# Altium schematic sheet Сharger for auto.SchDoc: Sonar Radio transmitter №1
size A4; ApprovedBy: Логвиненко; CheckedBy: Левинец; Author: Спеян; CompanyName: Garage; DrawnBy: 16; Engineer: ,; Organization: 23; Address1: Protect During; Address2: a Zombie; Address3: Apocalypse; Address4: №1. braaains.....; DocumentNumber: Garage; Revision: 1; SheetNumber: 1; SheetTotal: 1; Scale: 1:1; Name Value: Сонар; ProcessInspection: Сharger for auto.SchDoc; NormInspection: ,; Letter1Column: S; Letter2Column: -; Letter3Column: -; DocumentType: Схема електрическая принципиальная; Mass: .; FirstReferrence: SDE 525.1 111 017 ME; Grupa: gr. E-111; Time: Garage; Rule: 26; ImagePath: 18; Application_BuildNumber: 5
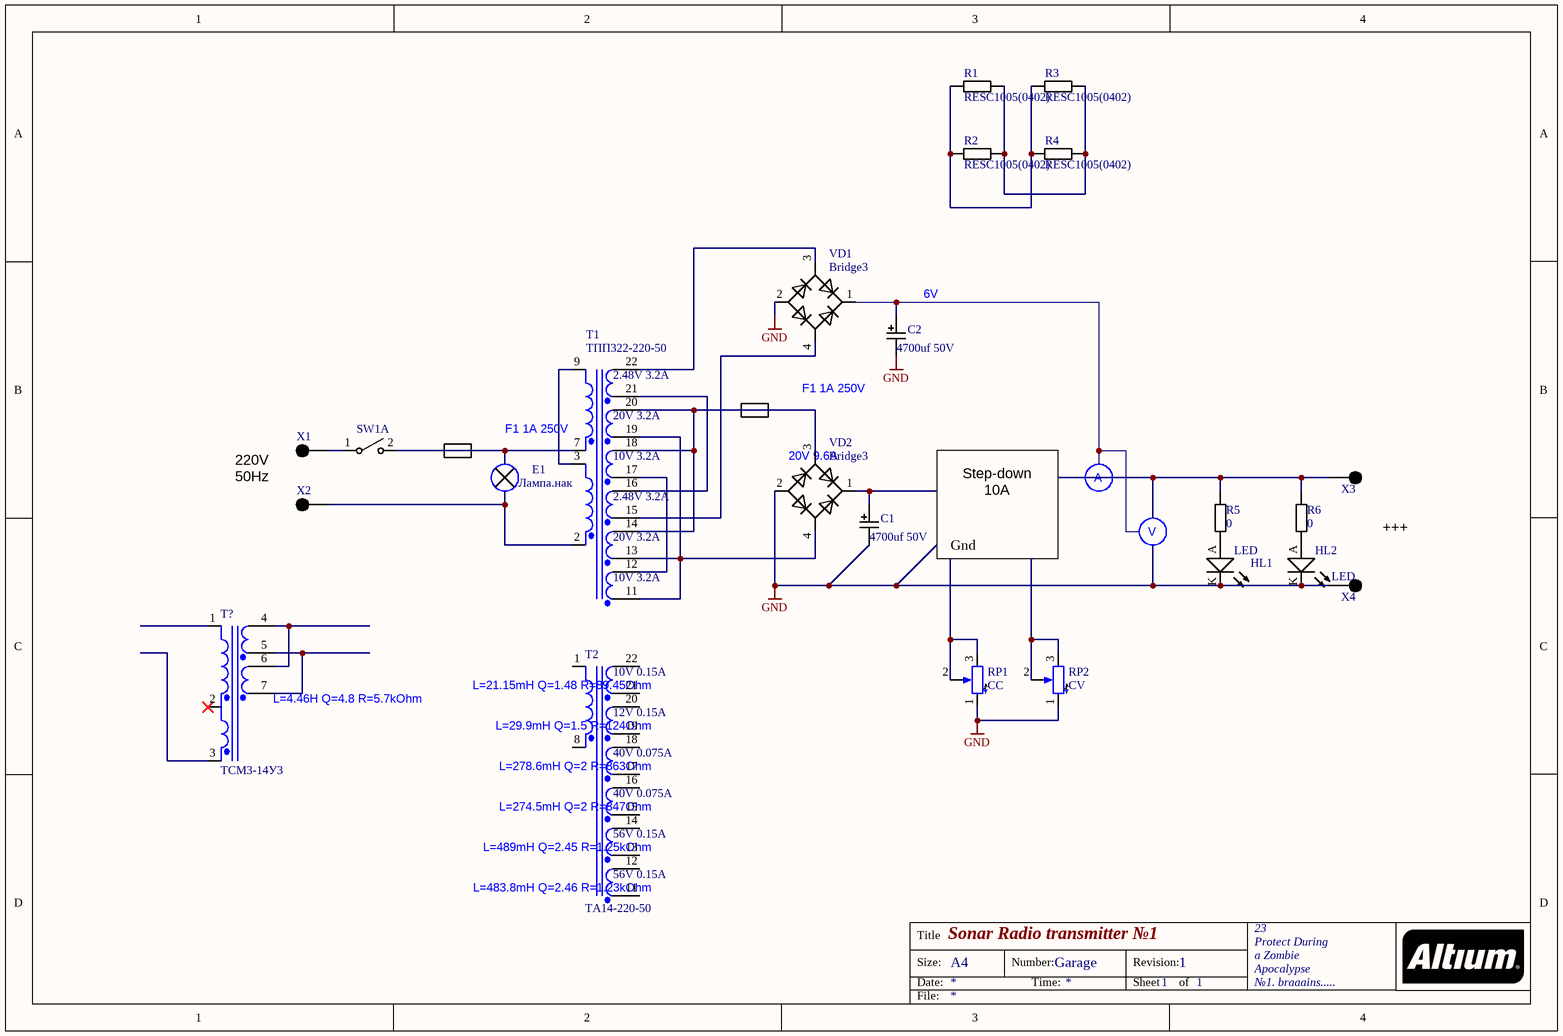
[diagram p0: Сharger for auto.SchDoc]

## Parts
C1  4700uf 50V  [CAPMP3528X210N]
C2  4700uf 50V  [CAPMP3528X210N]
E1  Лампа.нак
HL1  LED  [LED 5mm Green]
HL2  LED  [LED 5mm Green]
R1  RESC1005(0402)  [REZKemet 0402]
R2  RESC1005(0402)  [REZKemet 0402]
R3  RESC1005(0402)  [REZKemet 0402]
R4  RESC1005(0402)  [REZKemet 0402]
R5  0  [REZKemet 0402]
R6  0  [REZKemet 0402]
RP1  CC  [POT16K1-LIN]
RP2  CV  [POT16K1-LIN]
SW1  219-12MST  [219-12MST]  (value not drawn)  (part A of 12)
T1  ТПП322-220-50
T2  ТА14-220-50
T?  ТСМ3-14У3
VD1  Bridge3  [DF206ST-G]
VD2  Bridge3  [DF206ST-G]
X1  X1-PLS-1  [HoleSolderPLS-1]  (value not drawn)
X2  X1-PLS-1  [HoleSolderPLS-1]  (value not drawn)
X3  X1-PLS-1  [HoleSolderPLS-1]  (value not drawn)
X4  X1-PLS-1  [HoleSolderPLS-1]  (value not drawn)

## Nets
GND: C1.2 C2.2 HL1.K HL2.K RP1.1(TOP) RP2.1(TOP) VD1.2(A) VD2.2(A) X4.1
NetC1_1: C1.1 VD2.1(C)
NetC2_1: C2.1 VD1.1(C)
NetHL1_A: HL1.A R5.1
NetHL2_A: HL2.A R6.1
NetR1_1: R1.1 R2.1 R3.1 R4.1
NetR1_2: R1.2 R2.2 R3.2 R4.2
NetR5_2: R5.2 R6.2 X3.1
NetRP1_2: RP1.2(BOT) RP1.3(TAP)
NetRP2_2: RP2.2(BOT) RP2.3(TAP)
NetSW1_1: SW1.1 X1.1
NetSW1_2: SW1.2 T1.7(Pri2+)
NetT1_2: T1.2(Pri1+) X2.1
NetT1_3: T1.3(Pri1-) T1.9(Pri2-)
NetT1_11: T1.11(Sec2+) T1.13(Sec2+) T1.19(Sec2+) VD2.4(C)
NetT1_12: T1.12(Sec2-) T1.17(Sec2+)
NetT1_14: T1.14(Sec2-) T1.18(Sec2-) T1.20(Sec2-) VD2.3(C)
NetT1_15: T1.15(Sec2+) VD1.4(C)
NetT1_16: T1.16(Sec2-) T1.21(Sec2+)
NetT1_22: T1.22(Sec2-) VD1.3(C)
NetT?_4: T?.4(Sec2-) T?.6(Sec2-)
NetT?_5: T?.5(Sec2+) T?.7(Sec2+)

Not connected (* = marked no-connect by the designer): T2 1(Pri2-) 8(Pri2+) 11(Sec2+) 12(Sec2-) 13(Sec2+) 14(Sec2-) 15(Sec2+) 16(Sec2-) 17(Sec2+) 18(Sec2-) 19(Sec2+) 20(Sec2-) 21(Sec2+) 22(Sec2-); T? 1(Pri2-) 2(Pri2+)* 3(Pri1+)

## Notes on the sheet
- (near C2) 6V
- F1 1A 250V
- 220V
  50Hz
- (near VD2) 20V 9.6A
- Step-down 10A
- A
- Gnd
- V
- +++
- (near T2) L=4.46H Q=4.8 R=5.7kOhm
- (near T2) L=21.15mH Q=1.48 R=89.45Ohm
- (near T2) L=29.9mH Q=1.5 R=124Ohm
- (near T2) L=278.6mH Q=2 R=863Ohm
- (near T2) L=274.5mH Q=2 R=847Ohm
- (near T2) L=489mH Q=2.45 R=1.25kOhm
- (near T2) L=483.8mH Q=2.46 R=1.23kOhm
- Title
- Size:
- Date:
- A4
- Number:
- Time:
- Revision:
- Sheet
- of
- File:
- (in symbol ТА14-220-50) 10V 0.15A; 12V 0.15A; 40V 0.075A; 56V 0.15A
- (in symbol ТПП322-220-50) 2.48V 3.2A; 20V 3.2A; 10V 3.2A

## Library data of the parts
C1 C2 = CapTantB: ?; Manufacturer Part Number: TAJB107M010RNJ; Part Number: CapTantB; HelpURL: https://www.digikey.com/product-detail/en/avx-corporation/TAJB107M010RNJ/478-5801-1-ND/2136392; Digi-Key Part Number: 478-5801-1-ND; Price$: 0.71; Note: ?; Code_JEDEC: 1411 B
HL1 HL2 = FYL-5013 GD: ?; Part Number: FYL-5013 GD; Digi-Key Part Number: ?; Price$: ?; Note: ?; Manufacturer Part Number: ?; Code_JEDEC: ?
R1-R6 = RESC1005(0402): Note: ???; Part Number: RESC1005(0402); HelpURL: ???; Digi-Key Part Number: ???; Price$: ???; Manufacturer Part Number: ???; Code_JEDEC: ???
RP1 RP2 = 50k POT16K1-LIN: Note: ???; Part Number: 50k POT16K1-LIN; HelpURL: ???; Digi-Key Part Number: ???; Price$: ???; Manufacturer Part Number: ???; Code_JEDEC: ???
SW1 = 219-12MST: SWITCH SLIDE DIP SPST 100MA 20V; Note: ???; Part Number: 219-12MST; HelpURL: https://www.digikey.com/product-detail/en/cts-electrocomponents/219-12MST/CT21912MST-ND/223218; Digi-Key Part Number: CT21912MST-ND; Price$: 1.38; Manufacturer Part Number: 219-12MST; Code_JEDEC: ???
VD1 VD2 = DF10S-E3/77: Miniature Glass Passivated Single-Phase / Surface Mount Bridge Rectifiers; Part Number: DF10S-E3/77; HelpURL: https://ru.mouser.com/datasheet/2/427/dfs-240405.pdf; Price$: ?; Note: ?; Manufacturer Part Number: ?; Code_JEDEC: ?
X1-X4 = X1-PLS-1: контакт под пайку; Part Number: X1-PLS-1
E1 = Лампа.нак: Part Number: Лампа.нак
T1 = ТПП322-220-50: Published: 25-Jan-2001; LatestRevisionDate: 17-Jul-2002; LatestRevisionNote: Re-released for DXP Platform.; PackageReference: TRF_8; Publisher: Altium Limited; PackageDescription: Transformer; 8 Leads; Part Number: ТПП322-220-50; HelpURL: https://www.radiolibrary.ru/reference/transformers-tpp/tpp322.html
T2 = ТА14-220-50: Published: 25-Jan-2001; LatestRevisionDate: 17-Jul-2002; LatestRevisionNote: Re-released for DXP Platform.; PackageReference: TRF_8; Publisher: Altium Limited; PackageDescription: Transformer; 8 Leads; Part Number: ТА14-220-50; HelpURL: https://www.radiolibrary.ru/reference/transformers-ta/ta14.html
T? = ТСМ3-14У3: Part Number: ТСМ3-14У3